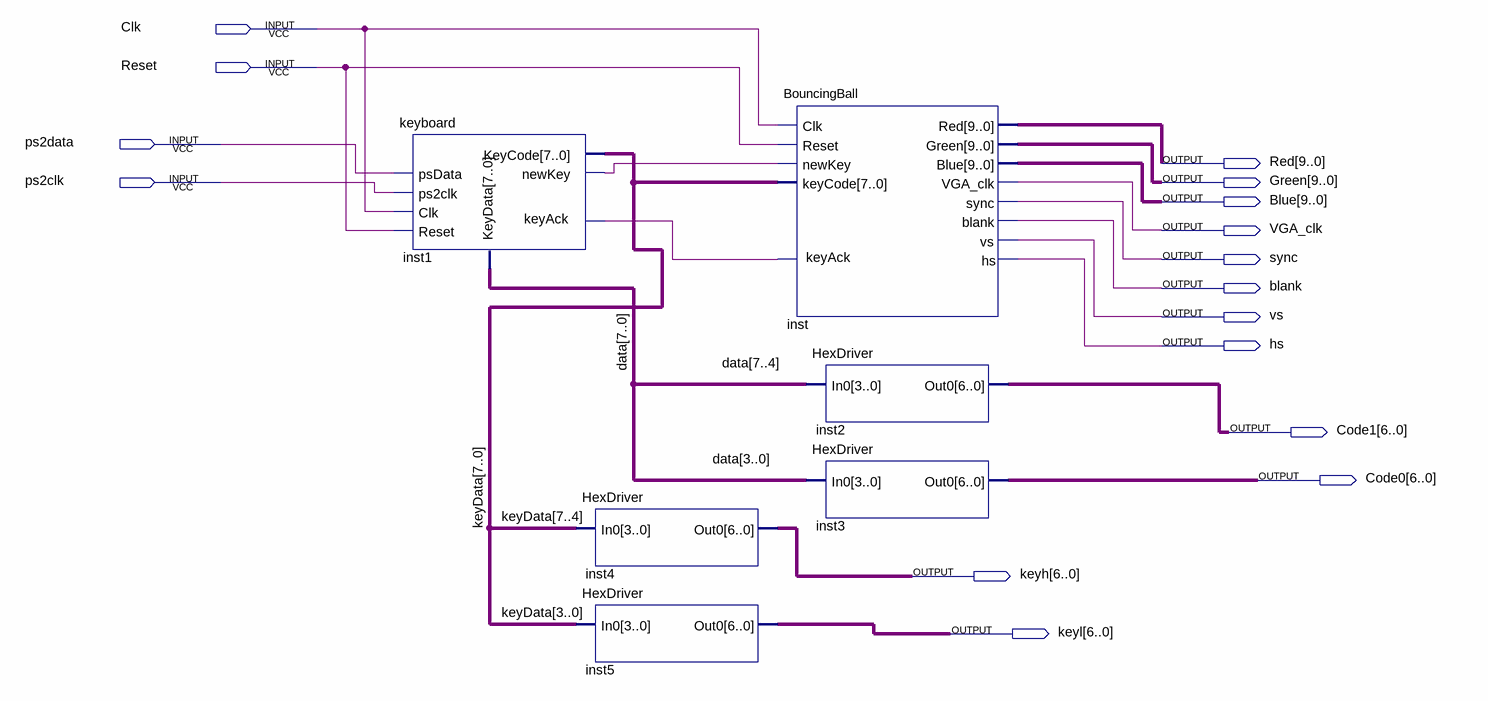
[diagram p0: schematic sheet]
// Quartus schematic lab8.bdf as structural Verilog: 6 symbols, 16 pins
module lab8 (
  input  Clk,
  input  Reset,
  input  ps2data,
  input  ps2clk,
  output [9:0] Red,
  output [9:0] Green,
  output [9:0] Blue,
  output VGA_clk,
  output sync,
  output blank,
  output vs,
  output hs,
  output [6:0] Code1,
  output [6:0] Code0,
  output [6:0] keyh,
  output [6:0] keyl
);

  wire inst1_newkey, inst_keyack;
  wire [7:0] data, keyData;

  keyboard inst1 (
    .keyAck(inst_keyack), .psData(ps2data), .ps2clk(ps2clk), .Clk(Clk), .Reset(Reset), .KeyCode(keyData),
    .newKey(inst1_newkey), .KeyData(data));
  HexDriver inst4 (.In0(keyData[7:4]), .Out0(keyh));
  HexDriver inst5 (.In0(keyData[3:0]), .Out0(keyl));
  BouncingBall inst (
    .Clk(Clk), .Reset(Reset), .newKey(inst1_newkey), .keyCode(keyData), .Red(Red), .Green(Green),
    .Blue(Blue), .keyAck(inst_keyack), .VGA_clk(VGA_clk), .sync(sync), .blank(blank), .vs(vs), .hs(hs));
  HexDriver inst2 (.In0(data[7:4]), .Out0(Code1));
  HexDriver inst3 (.In0(data[3:0]), .Out0(Code0));
endmodule
